# EasyEDA Pro project ProPrj_ESP32-C3-PICO开发板_2025-10-01.epro, board PCB1_12
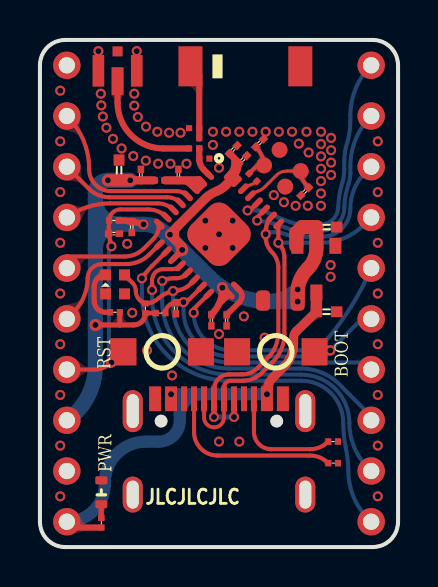
[diagram p10: board, top side]
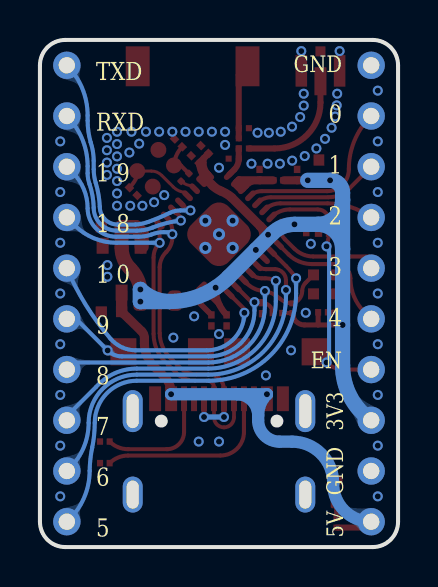
[diagram p11: board, bottom side, seen from below]

Outline 17.93 x 25.4 mm; copper layers: Top Layer, Bottom Layer. Coordinates in mm from the lower left corner of the outline.
Outline path: 0,24.13 0,1.27 arc(0.37,0.37) 1.27,0 16.66,0 arc(17.56,0.37) 17.93,1.27 17.93,24.13 arc(17.56,25.03) 16.66,25.4 1.27,25.4 arc(0.37,25.03) 0,24.13
Stack: Top Layer 0.035mm - / Dielectric1 0.91mm FR4 er 4.5 / Bottom Layer 0.035mm -

## Design rules (mm)
template: 自定义配置
spacing copperThickness1oz (default): track to track 0.102, other pairs 0.152 to 0.3
spacing copperThickness2oz: track to track 0.203, other pairs 0.152 to 0.3
track width copperThickness1oz (default): min 0.127, default 0.254, max 2.54
track width copperThickness2oz: min 0.203, default 0.254, max 2.54
differential pair differentialPair (default): width min 0.127, default 0.254, max 2.54; gap min 0.152, default 0.152
via viaSize (default): diameter min 0.5, default 0.61, max 10; hole min 0.3, default 0.305, max 6.299

## Placement (name value [footprint] x y rotation side)
ANT1  CrossAir CA-C03  [ant-smd_ca-c03]  10.29 24.08 0 top
C1  15pF  [C0201]  13.26 17.8 45 top
C2  15pF  [C0201]  11 20.24 45 top
C6  100nF  [C0201]  6.93 18.64 90 top
C8  100nF  [C0201]  5.05 18.64 90 top
C9  100nF  [C0201]  8.59 11.35 90 top
C11  100nF  [C0201]  4.6 16.03 270 top
C15  1uF  [C0402MINI]  14.35 16.03 180 top
C16  1uF  [C0402MINI]  14.35 11.79 180 top
C21  1uF  [C0201]  9.35 11.35 270 top
C22  10uF  [C0402MINI]  3.96 18.88 270 top
C24  100nF  [C0201]  6.81 11.96 90 top
C28  1uF  [C0201]  9.68 19.91 225 top
C29  10nF  [C0201]  10.16 19.41 45 top
C30  22uF  [cap-smd_l2.0-w1.3-fd]  12.04 12.34 180 top
C31  100nF  [C0201]  3.71 15.7 0 top
H7  X6511WV-10H-C30D60  [HDR-TH_10P-P2.54-V-M]  1.35 12.7 90 bottom
H8  X6511WV-10H-C30D60  [HDR-TH_10P-P2.54-V-M]  16.59 12.7 90 bottom
L1  3nH  [l0201]  7.72 20.98 180 top
L2  24nH  [l0201#2]  10.67 18.52 135 top
L3  2nH  [l0201-rd]  5.99 18.37 0 top
LED1  NCD0402R1  [LED0402MINI]  3.07 2.74 270 top
LED6  SK6805-EC15  [led-smd_4p-l1.5-w1.5-bl]  3.76 13.16 180 top
R2  NC  [r0201]  7.72 19.96 180 top
R3  10kΩ  [R0201]  5.28 11.96 270 top
R4  5.1kΩ  [R0201]  14.68 4.2 180 top
R5  5.1kΩ  [R0201]  14.68 5.28 180 top
R7  10kΩ  [R0201]  3.71 16.36 0 top
R8  5.1kΩ  [R0201]  3.07 1.22 270 top
R11  NC  [r0201]  8.23 19.46 0 top
R12  0Ω  [r0201]  7.98 20.22 90 top
R13  0Ω  [R0201]  3.76 11.76 0 top
R15  10kΩ  [R0201]  6.05 11.72 180 top
RF1  KH-IPEX4-2020  [ipex4-smd_4p-l1.8-w1.7-ls2.0-l_kh-ipex4-2020]  3.89 24.08 90 top
SW1  TS-1185-C-B-B-A  [sw-smd_l4.0-w2.9-ls5.0]  6.12 9.78 0 top
SW2  TS-1185-C-B-B-A  [sw-smd_l4.0-w2.9-ls5.0]  11.81 9.78 180 top
U1  ESP32-C3FH4  [QFN-32_L5.0-W5.0-P0.50-TL-EP3.7]  8.97 15.67 315 top
U2  ME6211A33M3G-N  [sot-23-3_l2.9-w1.6-p1.90-ls2.8-br]  13.84 13.92 90 top
U4  GT-USB-7010ASV  [usb-c-smd_g-switch_gt-usb-7010asv]  8.97 5.03 0 top
X1  40MHz  [crystal-smd_4p-l2.0-w1.6-bl]  12.14 18.97 315 top

## Footprints (pads in the part's own frame, mm; a bottom-side part is the same pattern mirrored in y, then rotated)
ant-smd_ca-c03
  rect 1.2x2 smd: 1(-2.75,0) 2(2.75,0)
C0201
  rect 0.368x0.324 smd: 1(-0.275,0) 2(0.275,0)
C0402MINI
  rect 0.567x0.54 smd: 1(-0.508,0) 2(0.508,0)
cap-smd_l2.0-w1.3-fd
  rrect 0.711x1.016 smd: 1(-0.864,0) 2(0.864,0)
crystal-smd_4p-l2.0-w1.6-bl
  rrect 0.8x0.8 smd: 1(-0.75,-0.55) 2(0.75,-0.55) 3(0.75,0.55) 4(-0.75,0.55)
HDR-TH_10P-P2.54-V-M
  round 1.371 hole 0.813: 1(-11.43,0) 2(-8.89,0) 3(-6.35,0) 4(-3.81,0) 5(-1.27,0) 6(1.27,0) 7(3.81,0) 8(6.35,0) 9(8.89,0) 10(11.43,0)
ipex4-smd_4p-l1.8-w1.7-ls2.0-l_kh-ipex4-2020
  rect 1.4x0.6 smd: 1(-0.748,0)
  rect 1.58x0.58 smd: 2(-0.228,-0.96) 4(-0.228,0.96)
  rect 0.5x0.5 smd: 3(0.748,0)
l0201
  rect 0.305x0.305 smd: 1(-0.254,0) 2(0.254,0)
l0201#2
  rrect 0.305x0.324 smd: 1(-0.275,0) 2(0.275,0)
l0201-rd
  rect 0.368x0.324 smd: 1(-0.275,0) 2(0.275,0)
LED0402MINI
  rrect 0.4x0.6 smd: 1(-0.6,0) 2(0.6,0)
led-smd_4p-l1.5-w1.5-bl
  rect 0.55x0.55 smd: 1(-0.475,-0.475) 2(0.475,-0.475) 3(0.475,0.475) 4(-0.475,0.475)
QFN-32_L5.0-W5.0-P0.50-TL-EP3.7
  rrect 0.65x0.28 smd: 1(-2.478,1.75) 2(-2.478,1.25) 3(-2.478,0.75) 4(-2.478,0.25) 5(-2.478,-0.25) 6(-2.478,-0.75) 7(-2.478,-1.25) 8(-2.478,-1.75) 17(2.478,-1.75) 18(2.478,-1.25)
  rrect 0.28x0.65 smd: 9(-1.75,-2.478) 10(-1.25,-2.478) 11(-0.75,-2.478) 12(-0.25,-2.478) 13(0.25,-2.478) 14(0.75,-2.478) 15(1.25,-2.478) 16(1.75,-2.478) 25(1.75,2.478) 26(1.25,2.478) 27(0.75,2.478) 28(0.25,2.478) 29(-0.25,2.478) 30(-0.75,2.478) 31(-1.25,2.478) 32(-1.75,2.478)
  rrect 2.642x2.642 smd: 33(0,0)
r0201
  rect 0.305x0.305 smd: 1(-0.254,0) 2(0.254,0)
R0201
  rect 0.303x0.324 smd: 1(-0.241,0) 2(0.241,0)
sot-23-3_l2.9-w1.6-p1.90-ls2.8-br
  rect 0.8x0.6 smd: 1(1.172,-0.95) 2(1.171,0.95) 3(-1.171,0)
sw-smd_l4.0-w2.9-ls5.0
  rect 1.3x1.36 smd: 1(-1.94,0) 2(1.94,0)
usb-c-smd_g-switch_gt-usb-7010asv
  oval 1x2.1 hole 0.6x1.7: 1(-4.32,1.78) 2(4.32,1.78)
  oval 1x1.8 hole 0.6x1.4: 3(4.32,-2.4) 4(-4.32,-2.4)
  rect 0.6x1.24 smd: A1B12(-3.2,2.4) A4B9(-2.4,2.4) B1A12(3.2,2.4) B4A9(2.4,2.4)
  rect 0.3x1.24 smd: A5(-1.25,2.4) A6(-0.25,2.4) A7(0.25,2.4) A8(1.25,2.4) B5(1.75,2.4) B6(0.75,2.4) B7(-0.75,2.4) B8(-1.75,2.4)

## Nets
As in the schematic.

Pads without a net: ANT1 2; LED6 3; U4 A8 B8

## Via types
v1: diameter 0.5, hole 0.299, Top Layer to Bottom Layer, 83 vias
v2: diameter 0.559, hole 0.305, Top Layer to Bottom Layer, 1 via
v3: diameter 0.61, hole 0.305, Top Layer to Bottom Layer, 11 vias
v4: diameter 0.5, hole 0.3, Top Layer to Bottom Layer, 11 vias

## Routing (per net, layer and track width the routed paths; a pad name or vN(x,y) marks a point on that pad's centre or on a via; arc(x,y) is an arc through that point)
GND:
  vias: v1(1.02,22.86) v1(1.02,20.32) v1(1.02,17.78) v1(1.02,15.24) v1(1.02,12.7) v1(1.02,10.16) v1(1.02,7.62) v1(1.02,5.08) v1(1.02,2.54) v1(2.93,24.84) v1(3.05,22.71) v1(3.07,22.12) v1(3.15,21.56) v1(3.33,21) v1(3.66,20.45) v1(4.09,19.96) v1(4.37,15.19) v1(4.67,19.58) v1(4.62,11.73) v1(4.72,22.71) v1(4.72,22.11) v1(4.85,24.84) v1(4.9,21.54) v1(5.31,21.06) v1(5.3,19.35) v1(5.36,9.85) v1(5.88,20.8) v1(6.47,20.75) v1(6.53,19.2) v1(6.62,8.6) v1(7.04,20.75) v1(7.34,19.2) v1(8.66,20.14) v1(8.97,19) v1(8.97,10.67) v1(8.97,5.28) v1(9.98,20.8) v1(9.98,5.28) v1(10.64,20.8) v1(11.3,20.8) v1(11.25,10.49) v1(11.71,17.63) v1(11.96,20.8) v1(12.62,20.8) v1(12.8,17.09) v1(12.96,20.21) v1(13.35,20.8) v1(13.41,17.09) v1(14.07,20.8) v1(14.07,20.18) v1(14.07,19.57) v1(14.07,18.95) v1(14.07,18.33) v1(14.07,17.71) v1(14.07,17.09) v1(14.58,20.49) v1(14.58,19.88) v1(14.58,19.26) v1(14.58,18.64) v1(14.55,13.54) v1(16.92,20.32) v1(16.92,17.78) v1(16.92,15.24) v1(16.92,12.7) v1(16.92,10.16) v1(16.92,7.62) v1(16.92,5.08) v1(16.92,2.54) v3(8.28,16.35) v3(8.28,14.98) v3(8.97,15.67) v3(9.65,16.35) v3(9.65,14.98) v4(5.92,19.2) v4(8.66,20.8) v4(9.32,20.8) v4(10.21,11.56) v4(12.22,17.27) v4(13.45,19.76) v4(14.55,14.12)
VBUS: length 24.3
  Top Layer w0.302: 1.35,1.27 1.64,0.98 R8.2
  Top Layer w0.457: v3(11.37,7.66) 11.37,7.74 arc(11.45,8.16) 11.68,8.51 12.23,9.05 arc(12.58,9.58) 12.7,10.2 12.7,10.47 arc(12.74,10.65) 12.84,10.81 C16.2 13.82,11.79
  Top Layer w0.567: U2.3 C16.2
  Bottom Layer w0.61: 7.01,6.59 7.01,6.35 arc(6.69,5.59) 5.94,5.28 5.31,5.28 arc(3.85,4.68) 3.25,3.22 3.25,3.17 arc(2.69,1.83) 1.35,1.27 ; 7.01,6.59 arc(7.32,7.34) 8.07,7.66 ; 7.01,6.59 arc(6.89,7.17) v3(6.57,7.66) 8.07,7.66 ; 8.07,7.66 v3(11.37,7.66)
VDD_3V3: length 57.1
  Top Layer w0.203: R3.2 arc(5.54,11.72) R15.2
  Top Layer w0.254: 4,11.12 v3(2.78,11.12) ; 4,11.12 4.69,11.12 arc(5.11,11.3) R3.2 ; 4,11.12 R13.2
  Top Layer w0.28: 9.73,19.48 9.73,19.25 arc(9.66,18.93) U1.32 ; v2(9.13,12.99) U1.17 8.95,12.15 ; 9.78,18.61 9.73,18.66 9.68,18.66 ; 9.78,18.61 9.95,18.44 ; 9.78,18.61 arc(9.9,18.86) 9.96,19.14 ; 9.96,19.14 9.91,19.08 ; 9.96,19.14 9.97,19.14 C29.1 arc(9.97,19.17) 9.96,19.14 ; 9.91,19.08 U1.32 ; 9.91,19.08 arc(9.76,18.89) 9.68,18.66 ; 9.68,18.66 U1.32 ; v3(7.12,14.88) U1.11
  Top Layer w0.305: R7.2 arc(4.28,16.34) 4.6,16.31 arc(4.9,16.25) v1(5.19,16.16)
  Top Layer w0.325: v2(9.13,12.99) 9.13,12.95 arc(9.09,12.54) 8.95,12.15 arc(8.79,11.87) C9.2
  Top Layer w0.33: C28.2 9.73,19.48 9.97,19.24 C29.1
  Top Layer w0.406: v1(4.52,18.37) C8.1 L3.1
  Top Layer w0.457: 6.91,16.08 6.51,15.68 v1(6.51,15.65) 6.8,15.36 ; 6.91,16.08 8.33,17.51 arc(8.58,17.69) 8.86,17.83 arc(9.09,17.95) 9.3,18.12 9.66,18.48 ; 6.91,16.08 arc(6.77,15.88) 6.73,15.65 arc(6.75,15.5) 6.8,15.36 ; v3(7.12,14.88) 7.12,15.03 6.8,15.36
  Top Layer w0.61: v1(3.4,18.37) C22.2 v1(4.52,18.37)
  Top Layer w0.711: 13.84,15.01 C15.2 13.13,16.03 12.84,15.73 12.84,15.06 ; v3(12.9,12.29) v3(12.9,12.9) arc(13.07,13.47) 13.41,13.94 arc(13.73,14.42) 13.84,14.98
  Bottom Layer w0.762: 11.44,12.3 v3(12.9,12.29) v3(12.9,12.9) arc(12.23,12.46) 11.44,12.3 ; 11.44,12.3 arc(10.24,12.47) v2(9.13,12.99) arc(8.79,13.24) 8.48,13.53 v3(7.12,14.88) 6.3,15.7 arc(5.79,16.04) v1(5.19,16.16) 4.01,16.16 ; 2.78,17.39 2.78,14.93 ; 2.78,17.39 2.78,17.74 arc(2.96,18.19) v1(3.4,18.37) v1(4.52,18.37) ; 2.78,17.39 arc(3.14,16.52) 4.01,16.16 ; 2.78,14.93 v3(2.78,11.12) 2.78,9.09 arc(2.4,7.55) 1.35,6.35 ; 2.78,14.93 arc(3.14,15.8) 4.01,16.16
VDD_SPI: length 1.8
  Top Layer w0.28: 9.83,13.03 9.98,12.88 arc(10.08,12.74) 10.11,12.58 arc(10.07,12.4) 9.98,12.26 C21.1
CHIP_EN: length 13.8
  Top Layer w0.203: v4(3.58,15.06) C31.1 R7.1 arc(3.63,16.75) 4.02,16.91 5.42,16.91 arc(5.91,16.81) U1.7 ; H7.4 2.72,8.89 arc(3.19,8.98) v4(3.58,9.25)
  Top Layer w0.5: v4(3.58,9.25) 4.11,9.78 SW1.1
  Bottom Layer w0.203: v4(3.58,9.25) 3.45,9.25 3.45,15.06 v4(3.58,15.06)
GPIO0: length 8.6
  Top Layer w0.203: H7.9 1.39,21.55 arc(2.18,20.36) 2.46,18.95 2.46,18.92 arc(2.78,18.15) 3.56,17.83 6.83,17.83 arc(7.13,17.77) U1.4
GPIO1: length 6.3
  Top Layer w0.203: H7.8 2.44,17.96 arc(2.92,17.63) 3.49,17.52 6.37,17.52 arc(6.73,17.45) U1.5
GPIO2: length 5.6
  Top Layer w0.203: U1.6 arc(6.32,17.13) 5.89,17.21 3.53,17.21 arc(2.38,17.03) 1.35,16.51
GPIO3: length 6
  Top Layer w0.203: H7.6 1.35,14.55 4.24,14.55 arc(4.76,14.66) 5.19,14.95 5.66,15.41 arc(5.89,15.76) U1.8
GPIO4: length 6.7
  Top Layer w0.203: 1.35,11.43 1.69,11.77 arc(2.21,12.55) 2.39,13.46 arc(2.6,13.96) 3.1,14.17 4.32,14.17 arc(4.95,14.3) 5.48,14.65 U1.9
GPIO5: length 21.7
  Top Layer w0.203: 6.33,14.8 5.62,14.08 arc(5.35,13.78) v1(5.11,13.46)
  Bottom Layer w0.203: v1(5.11,13.46) 5.11,12.7 arc(6.38,9.61) 9.47,8.33 13.08,8.33 arc(14.57,7.71) 15.19,6.22 arc(15.22,5.6) 15.32,4.98 arc(15.41,4.4) 15.44,3.82 arc(15.74,2.43) 16.59,1.27
GPIO6: length 18.8
  Top Layer w0.203: v1(5.61,12.88) 5.61,13.36 arc(5.78,13.76) 6.17,13.92 6.62,13.92 arc(6.85,13.96) U1.12
  Bottom Layer w0.203: H8.2 16.43,3.97 arc(15.74,5) 15.49,6.22 arc(14.79,7.93) 13.08,8.64 9.5,8.64 arc(6.75,9.77) 5.61,12.52 v1(5.61,12.88)
GPIO7: length 15.9
  Top Layer w0.203: U1.13 7.32,13.66 arc(7.09,13.51) 6.83,13.46 6.65,13.46 arc(6.38,13.43) v1(6.12,13.33)
  Bottom Layer w0.203: v1(6.12,13.33) 6.12,12.32 arc(7.11,9.93) 9.5,8.94 13.08,8.94 arc(14.2,8.7) 15.12,8.02 16.59,6.55 16.59,6.35
GPIO8: length 17.1
  Top Layer w0.203: U1.14 7.56,13.2 arc(7.15,12.92) v1(6.67,12.83) arc(6.27,12.68) 5.92,12.45 arc(5.62,12.27) R3.1 arc(4.94,12.43) 4.8,12.83 arc(4.76,13.05) 4.63,13.23 LED6.1
  Bottom Layer w0.203: H8.4 16.23,9.25 9.5,9.25 arc(7.5,10.08) 6.67,12.08 v1(6.67,12.83)
GPIO9/BOOT: length 15.1
  Top Layer w0.203: v1(7.19,12.27) 7.34,12.27 8.1,13.03 ; C24.2 6.8,12.24 arc(6.44,12.09) R15.1
  Top Layer w0.305: v1(7.19,12.27) C24.2
  Top Layer w0.5: v1(14.54,9.85) 13.82,9.85 SW2.1
  Bottom Layer w0.203: v1(7.19,12.27) 7.19,11.85 arc(7.86,10.22) 9.49,9.55 13.82,9.55 arc(14.21,9.63) v1(14.54,9.85) 16.12,11.43 16.59,11.43
GPIO10: length 13.4
  Top Layer w0.203: U1.16 7.7,11.92 v1(7.7,11.73)
  Bottom Layer w0.203: v1(7.7,11.73) arc(8.25,10.41) 9.58,9.85 13.13,9.85 arc(13.83,10.01) 14.4,10.44 arc(15.63,12.12) H8.6
GPIO18/USB_DN: length 19.2
  Top Layer w0.191: U4.A7 9.22,6.49 arc(9.07,6.14) 8.72,5.99 arc(8.36,6.14) 8.22,6.49 U4.B7
  Top Layer w0.203: U4.A7 9.22,8 arc(9.31,8.23) 9.55,8.33 10.16,8.33 arc(10.68,8.43) 11.11,8.73 11.66,9.27 arc(12.09,9.92) 12.24,10.68 12.24,14.5 arc(12.16,14.9) v1(11.94,15.24) 11.94,16.16 U1.25
  Bottom Layer w0.203: 16.59,16.51 16.18,16.1 arc(15.22,15.46) 14.09,15.24 v1(11.94,15.24)
GPIO19/USB_DP: length 21.7
  Top Layer w0.203: U4.A6 8.72,7.89 arc(8.94,8.43) 9.48,8.65 10.11,8.65 arc(10.54,8.74) 10.91,8.98 11.42,9.49 arc(11.8,10.05) 11.94,10.71 11.94,14.02 arc(11.85,14.43) 11.61,14.78 arc(11.38,15.12) 11.3,15.52 v1(11.3,15.67) 11.3,15.81 arc(11.38,16.2) U1.26
  Top Layer w0.254: U4.A6 v1(8.72,6.51) ; U4.B6 v1(9.72,6.51)
  Bottom Layer w0.203: H8.8 16.28,18.74 arc(15.74,17.93) 15.54,16.97 arc(15.13,15.96) 14.12,15.54 13,15.54 arc(12.68,15.57) 12.37,15.64 arc(12.06,15.74) 11.73,15.77 11.3,15.77 v1(11.3,15.67)
  Bottom Layer w0.254: v1(9.72,6.51) v1(8.72,6.51)
GPIO20/U0RXD: length 10.7
  Top Layer w0.203: U1.27 10.88,16.52 v4(10.88,16.35)
  Bottom Layer w0.203: H8.9 arc(15.82,20.44) 15.54,19.08 15.54,18.72 arc(15.52,18.44) 15.44,18.16 arc(15.3,17.58) 15.24,16.99 arc(14.91,16.18) 14.1,15.85 13.08,15.85 arc(12.68,15.89) 12.29,16 arc(11.6,16.23) v4(10.88,16.35)
GPIO21/U0TXD: length 13.5
  Top Layer w0.203: v4(10.4,16.86) 10.51,16.86 U1.28
  Bottom Layer w0.203: 16.39,23.93 H8.10 arc(15.82,22.98) 15.54,21.62 15.54,21.36 arc(15.51,20.81) 15.39,20.27 arc(15.28,19.82) 15.24,19.35 15.24,18.92 arc(15.21,18.58) 15.14,18.24 arc(15,17.65) 14.94,17.04 arc(14.67,16.41) 14.05,16.15 13.16,16.15 arc(12.83,16.19) 12.52,16.28 arc(11.97,16.5) 11.43,16.74 arc(11.17,16.83) 10.9,16.86 v4(10.4,16.86)
USB_CC1: length 9.2
  Top Layer w0.203: U4.A5 7.72,5.77 arc(8.06,4.93) 8.9,4.58 13.52,4.58 arc(14.02,4.49) R4.2
USB_CC2: length 6
  Top Layer w0.203: 10.72,7.4 10.72,5.77 arc(10.97,5.15) 11.58,4.9 13.52,4.9 arc(14.02,5) R5.2
$1N537: length 3.5
  Top Layer w0.152: X1.3 12.35,18.83 arc(12.07,18.78) 11.84,18.62 11.25,18.03 arc(10.99,17.85) 10.68,17.77
  Top Layer w0.203: C1.2 arc(13.22,18.28) 13.05,18.6
$1N9429: length 0.7
  Top Layer w0.254: LED1.2 R8.1
$1N59078: length 2
  Top Layer w0.203: L2.2 10.88,19.11 X1.1 arc(11.1,19.62) C2.1
$1N59083: length 0.6
  Top Layer w0.152: 10.82,18.3 arc(10.58,18.15) 10.3,18.11
$1N70790: length 5.9
  Top Layer w0.305: R2.2 6.18,19.96 arc(4.56,20.64) 3.89,22.26 3.89,23.25
$1N70798: length 1.5
  Top Layer w0.305: U1.1 8.2,18.9 arc(8.03,19.16) 7.97,19.46 ; R11.1 R2.1
$1N70816: length 3.8
  Top Layer w0.305: R12.2 L1.1 7.98,23.64 ANT1.1
$1N70868: length 3.1
  Top Layer w0.28: U1.3 7.6,18.09 arc(7.29,18.3) C6.1 ; U1.2 8.06,18.27
  Top Layer w0.406: L3.2 C6.1 7.96,18.37 8.06,18.27
  Top Layer w0.533: 8.04,18.19 7.86,18.01
$1N74389: length 2.8
  Top Layer w0.254: R13.1 3.28,11.76 arc(2.88,11.92) 2.72,12.32 2.72,13.07 arc(2.88,13.47) LED6.2

## Copper pours and planes (outline as drawn; the poured copper is in the pictures)
GND on Top Layer: -3.73,26.62 19.13,26.62 19.13,-1.32 -3.73,-1.32
GND on Bottom Layer: -1.19,26.62 21.67,26.62 21.67,-1.32 -1.19,-1.32

Small or netless copper shapes (teardrops, artwork), in the pictures only: 122 on Top Layer, 29 on Bottom Layer

## Text on the board
Bottom Silkscreen Layer: 3V3 | GND | 5V | EN | TXD | RXD | 1 9 | 1 8 | 1 0 | 9 | 8 | 7 | 6 | 5 | 0 | 1 | 2 | 3 | 4
Top Silkscreen Layer: JLCJLCJLC | RST | PWR | BOOT
